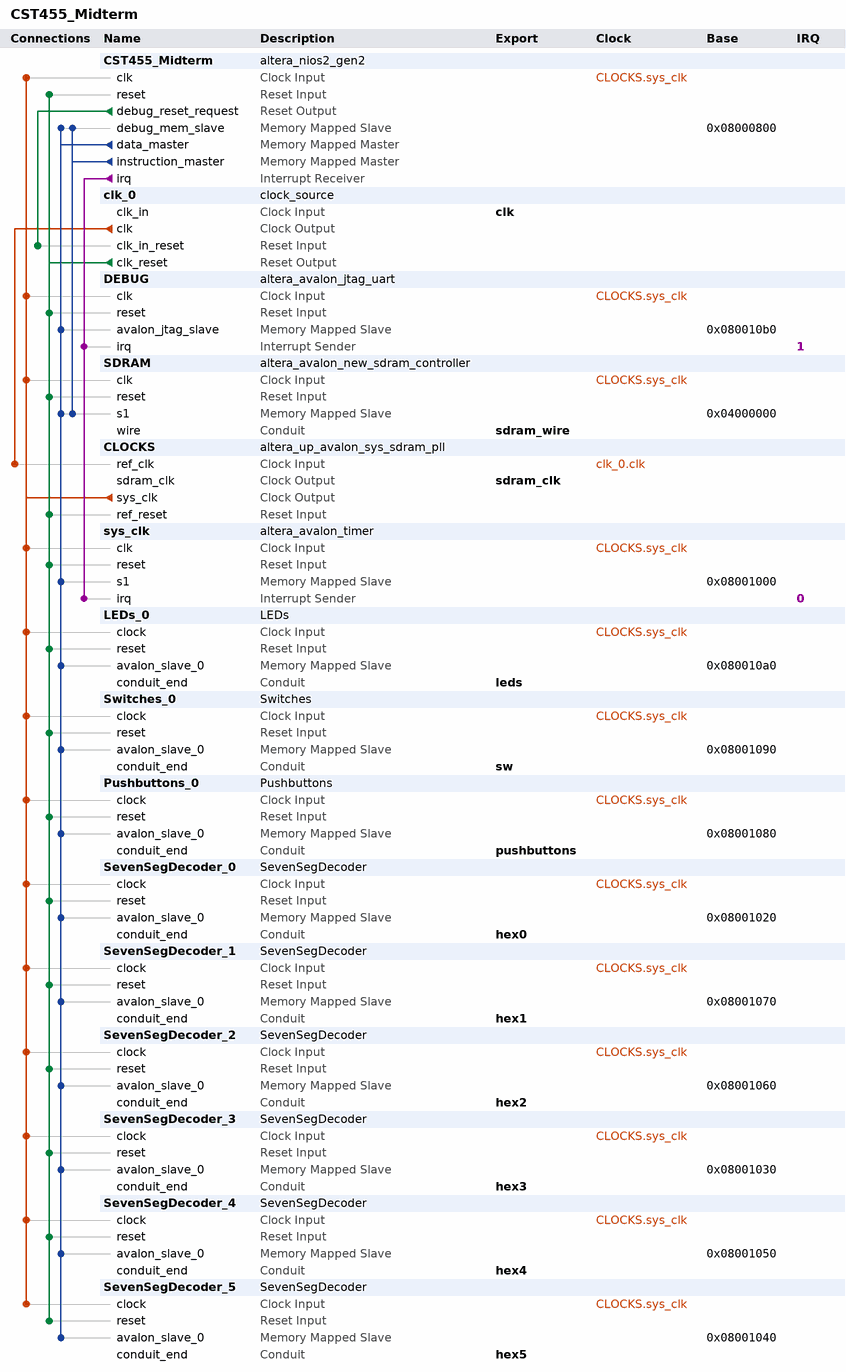
[diagram p0: system contents]
# Platform Designer (Qsys) system CST455_Midterm, Cyclone V 5CSXFC6D6F31C6
# Parameters at their usual value, and those the tool derives, are not listed.
package require -exact qsys 22.1
create_system CST455_Midterm
set_project_property DEVICE_FAMILY {Cyclone V}
set_project_property DEVICE 5CSXFC6D6F31C6

add_instance CST455_Midterm altera_nios2_gen2 22.1
set_instance_parameter_value CST455_Midterm dcache_size 2048
set_instance_parameter_value CST455_Midterm exceptionSlave SDRAM.s1
set_instance_parameter_value CST455_Midterm icache_size 4096
set_instance_parameter_value CST455_Midterm impl Tiny
set_instance_parameter_value CST455_Midterm resetSlave SDRAM.s1

add_instance clk_0 clock_source 22.1
set_instance_parameter_value clk_0 clockFrequency 50000000

add_instance DEBUG altera_avalon_jtag_uart 22.1
set_instance_parameter_value DEBUG simInteractiveOptions NO_INTERACTIVE_WINDOWS

add_instance SDRAM altera_avalon_new_sdram_controller 20.1
set_instance_parameter_value SDRAM TAC 5.4
set_instance_parameter_value SDRAM TRCD 15.0
set_instance_parameter_value SDRAM TRP 15.0
set_instance_parameter_value SDRAM casLatency 3
set_instance_parameter_value SDRAM columnWidth 10
set_instance_parameter_value SDRAM dataWidth 16
set_instance_parameter_value SDRAM generateSimulationModel false
set_instance_parameter_value SDRAM model single_Micron_MT48LC4M32B2_7_chip
set_instance_parameter_value SDRAM numberOfBanks 4
set_instance_parameter_value SDRAM numberOfChipSelects 1
set_instance_parameter_value SDRAM powerUpDelay 100.0
set_instance_parameter_value SDRAM refreshPeriod 7.8125
set_instance_parameter_value SDRAM rowWidth 13

add_instance CLOCKS altera_up_avalon_sys_sdram_pll 18.0
set_instance_parameter_value CLOCKS CV_boards DE10-Standard
set_instance_parameter_value CLOCKS gui_outclk 50.0
set_instance_parameter_value CLOCKS gui_refclk 50.0

add_instance sys_clk altera_avalon_timer 22.1
set_instance_parameter_value sys_clk period 1
set_instance_parameter_value sys_clk periodUnits MSEC

add_instance LEDs_0 LEDs 1.0

add_instance Switches_0 Switches 1.0

add_instance Pushbuttons_0 Pushbuttons 1.0

add_instance SevenSegDecoder_0 SevenSegDecoder 1.0

add_instance SevenSegDecoder_1 SevenSegDecoder 1.0

add_instance SevenSegDecoder_2 SevenSegDecoder 1.0

add_instance SevenSegDecoder_3 SevenSegDecoder 1.0

add_instance SevenSegDecoder_4 SevenSegDecoder 1.0

add_instance SevenSegDecoder_5 SevenSegDecoder 1.0

# connections
add_connection clk_0.clk CLOCKS.ref_clk clock
add_connection CLOCKS.sys_clk CST455_Midterm.clk clock
add_connection CLOCKS.sys_clk DEBUG.clk clock
add_connection CLOCKS.sys_clk LEDs_0.clock clock
add_connection CLOCKS.sys_clk Pushbuttons_0.clock clock
add_connection CLOCKS.sys_clk SDRAM.clk clock
add_connection CLOCKS.sys_clk SevenSegDecoder_0.clock clock
add_connection CLOCKS.sys_clk SevenSegDecoder_1.clock clock
add_connection CLOCKS.sys_clk SevenSegDecoder_2.clock clock
add_connection CLOCKS.sys_clk SevenSegDecoder_3.clock clock
add_connection CLOCKS.sys_clk SevenSegDecoder_4.clock clock
add_connection CLOCKS.sys_clk SevenSegDecoder_5.clock clock
add_connection CLOCKS.sys_clk Switches_0.clock clock
add_connection CLOCKS.sys_clk sys_clk.clk clock
add_connection clk_0.clk_reset CLOCKS.ref_reset reset
add_connection clk_0.clk_reset CST455_Midterm.reset reset
add_connection clk_0.clk_reset DEBUG.reset reset
add_connection clk_0.clk_reset LEDs_0.reset reset
add_connection clk_0.clk_reset Pushbuttons_0.reset reset
add_connection clk_0.clk_reset SDRAM.reset reset
add_connection clk_0.clk_reset SevenSegDecoder_0.reset reset
add_connection clk_0.clk_reset SevenSegDecoder_1.reset reset
add_connection clk_0.clk_reset SevenSegDecoder_2.reset reset
add_connection clk_0.clk_reset SevenSegDecoder_3.reset reset
add_connection clk_0.clk_reset SevenSegDecoder_4.reset reset
add_connection clk_0.clk_reset SevenSegDecoder_5.reset reset
add_connection clk_0.clk_reset Switches_0.reset reset
add_connection clk_0.clk_reset sys_clk.reset reset
add_connection CST455_Midterm.debug_reset_request clk_0.clk_in_reset reset
add_connection CST455_Midterm.data_master CST455_Midterm.debug_mem_slave avalon
set_connection_parameter_value CST455_Midterm.data_master/CST455_Midterm.debug_mem_slave baseAddress 0x08000800
add_connection CST455_Midterm.data_master DEBUG.avalon_jtag_slave avalon
set_connection_parameter_value CST455_Midterm.data_master/DEBUG.avalon_jtag_slave baseAddress 0x080010b0
add_connection CST455_Midterm.data_master LEDs_0.avalon_slave_0 avalon
set_connection_parameter_value CST455_Midterm.data_master/LEDs_0.avalon_slave_0 baseAddress 0x080010a0
add_connection CST455_Midterm.data_master Pushbuttons_0.avalon_slave_0 avalon
set_connection_parameter_value CST455_Midterm.data_master/Pushbuttons_0.avalon_slave_0 baseAddress 0x08001080
add_connection CST455_Midterm.data_master SDRAM.s1 avalon
set_connection_parameter_value CST455_Midterm.data_master/SDRAM.s1 baseAddress 0x04000000
add_connection CST455_Midterm.data_master SevenSegDecoder_0.avalon_slave_0 avalon
set_connection_parameter_value CST455_Midterm.data_master/SevenSegDecoder_0.avalon_slave_0 baseAddress 0x08001020
add_connection CST455_Midterm.data_master SevenSegDecoder_1.avalon_slave_0 avalon
set_connection_parameter_value CST455_Midterm.data_master/SevenSegDecoder_1.avalon_slave_0 baseAddress 0x08001070
add_connection CST455_Midterm.data_master SevenSegDecoder_2.avalon_slave_0 avalon
set_connection_parameter_value CST455_Midterm.data_master/SevenSegDecoder_2.avalon_slave_0 baseAddress 0x08001060
add_connection CST455_Midterm.data_master SevenSegDecoder_3.avalon_slave_0 avalon
set_connection_parameter_value CST455_Midterm.data_master/SevenSegDecoder_3.avalon_slave_0 baseAddress 0x08001030
add_connection CST455_Midterm.data_master SevenSegDecoder_4.avalon_slave_0 avalon
set_connection_parameter_value CST455_Midterm.data_master/SevenSegDecoder_4.avalon_slave_0 baseAddress 0x08001050
add_connection CST455_Midterm.data_master SevenSegDecoder_5.avalon_slave_0 avalon
set_connection_parameter_value CST455_Midterm.data_master/SevenSegDecoder_5.avalon_slave_0 baseAddress 0x08001040
add_connection CST455_Midterm.data_master Switches_0.avalon_slave_0 avalon
set_connection_parameter_value CST455_Midterm.data_master/Switches_0.avalon_slave_0 baseAddress 0x08001090
add_connection CST455_Midterm.data_master sys_clk.s1 avalon
set_connection_parameter_value CST455_Midterm.data_master/sys_clk.s1 baseAddress 0x08001000
add_connection CST455_Midterm.instruction_master CST455_Midterm.debug_mem_slave avalon
set_connection_parameter_value CST455_Midterm.instruction_master/CST455_Midterm.debug_mem_slave baseAddress 0x08000800
add_connection CST455_Midterm.instruction_master SDRAM.s1 avalon
set_connection_parameter_value CST455_Midterm.instruction_master/SDRAM.s1 baseAddress 0x04000000
add_connection CST455_Midterm.irq DEBUG.irq interrupt
set_connection_parameter_value CST455_Midterm.irq/DEBUG.irq irqNumber 1
add_connection CST455_Midterm.irq sys_clk.irq interrupt
set_connection_parameter_value CST455_Midterm.irq/sys_clk.irq irqNumber 0

# exported interfaces
add_interface clk clock sink
set_interface_property clk EXPORT_OF clk_0.clk_in
add_interface hex0 conduit end
set_interface_property hex0 EXPORT_OF SevenSegDecoder_0.conduit_end
add_interface hex1 conduit end
set_interface_property hex1 EXPORT_OF SevenSegDecoder_1.conduit_end
add_interface hex2 conduit end
set_interface_property hex2 EXPORT_OF SevenSegDecoder_2.conduit_end
add_interface hex3 conduit end
set_interface_property hex3 EXPORT_OF SevenSegDecoder_3.conduit_end
add_interface hex4 conduit end
set_interface_property hex4 EXPORT_OF SevenSegDecoder_4.conduit_end
add_interface hex5 conduit end
set_interface_property hex5 EXPORT_OF SevenSegDecoder_5.conduit_end
add_interface leds conduit end
set_interface_property leds EXPORT_OF LEDs_0.conduit_end
add_interface pushbuttons conduit end
set_interface_property pushbuttons EXPORT_OF Pushbuttons_0.conduit_end
add_interface sdram_clk clock source
set_interface_property sdram_clk EXPORT_OF CLOCKS.sdram_clk
add_interface sdram_wire conduit end
set_interface_property sdram_wire EXPORT_OF SDRAM.wire
add_interface sw conduit end
set_interface_property sw EXPORT_OF Switches_0.conduit_end

set_interconnect_requirement {$system} qsys_mm.clockCrossingAdapter HANDSHAKE
set_interconnect_requirement {$system} qsys_mm.enableEccProtection FALSE
set_interconnect_requirement {$system} qsys_mm.insertDefaultSlave FALSE
set_interconnect_requirement {$system} qsys_mm.maxAdditionalLatency 1

save_system CST455_Midterm.qsys
